# EAGLE design pc-003 (EAGLE 9.6.2)
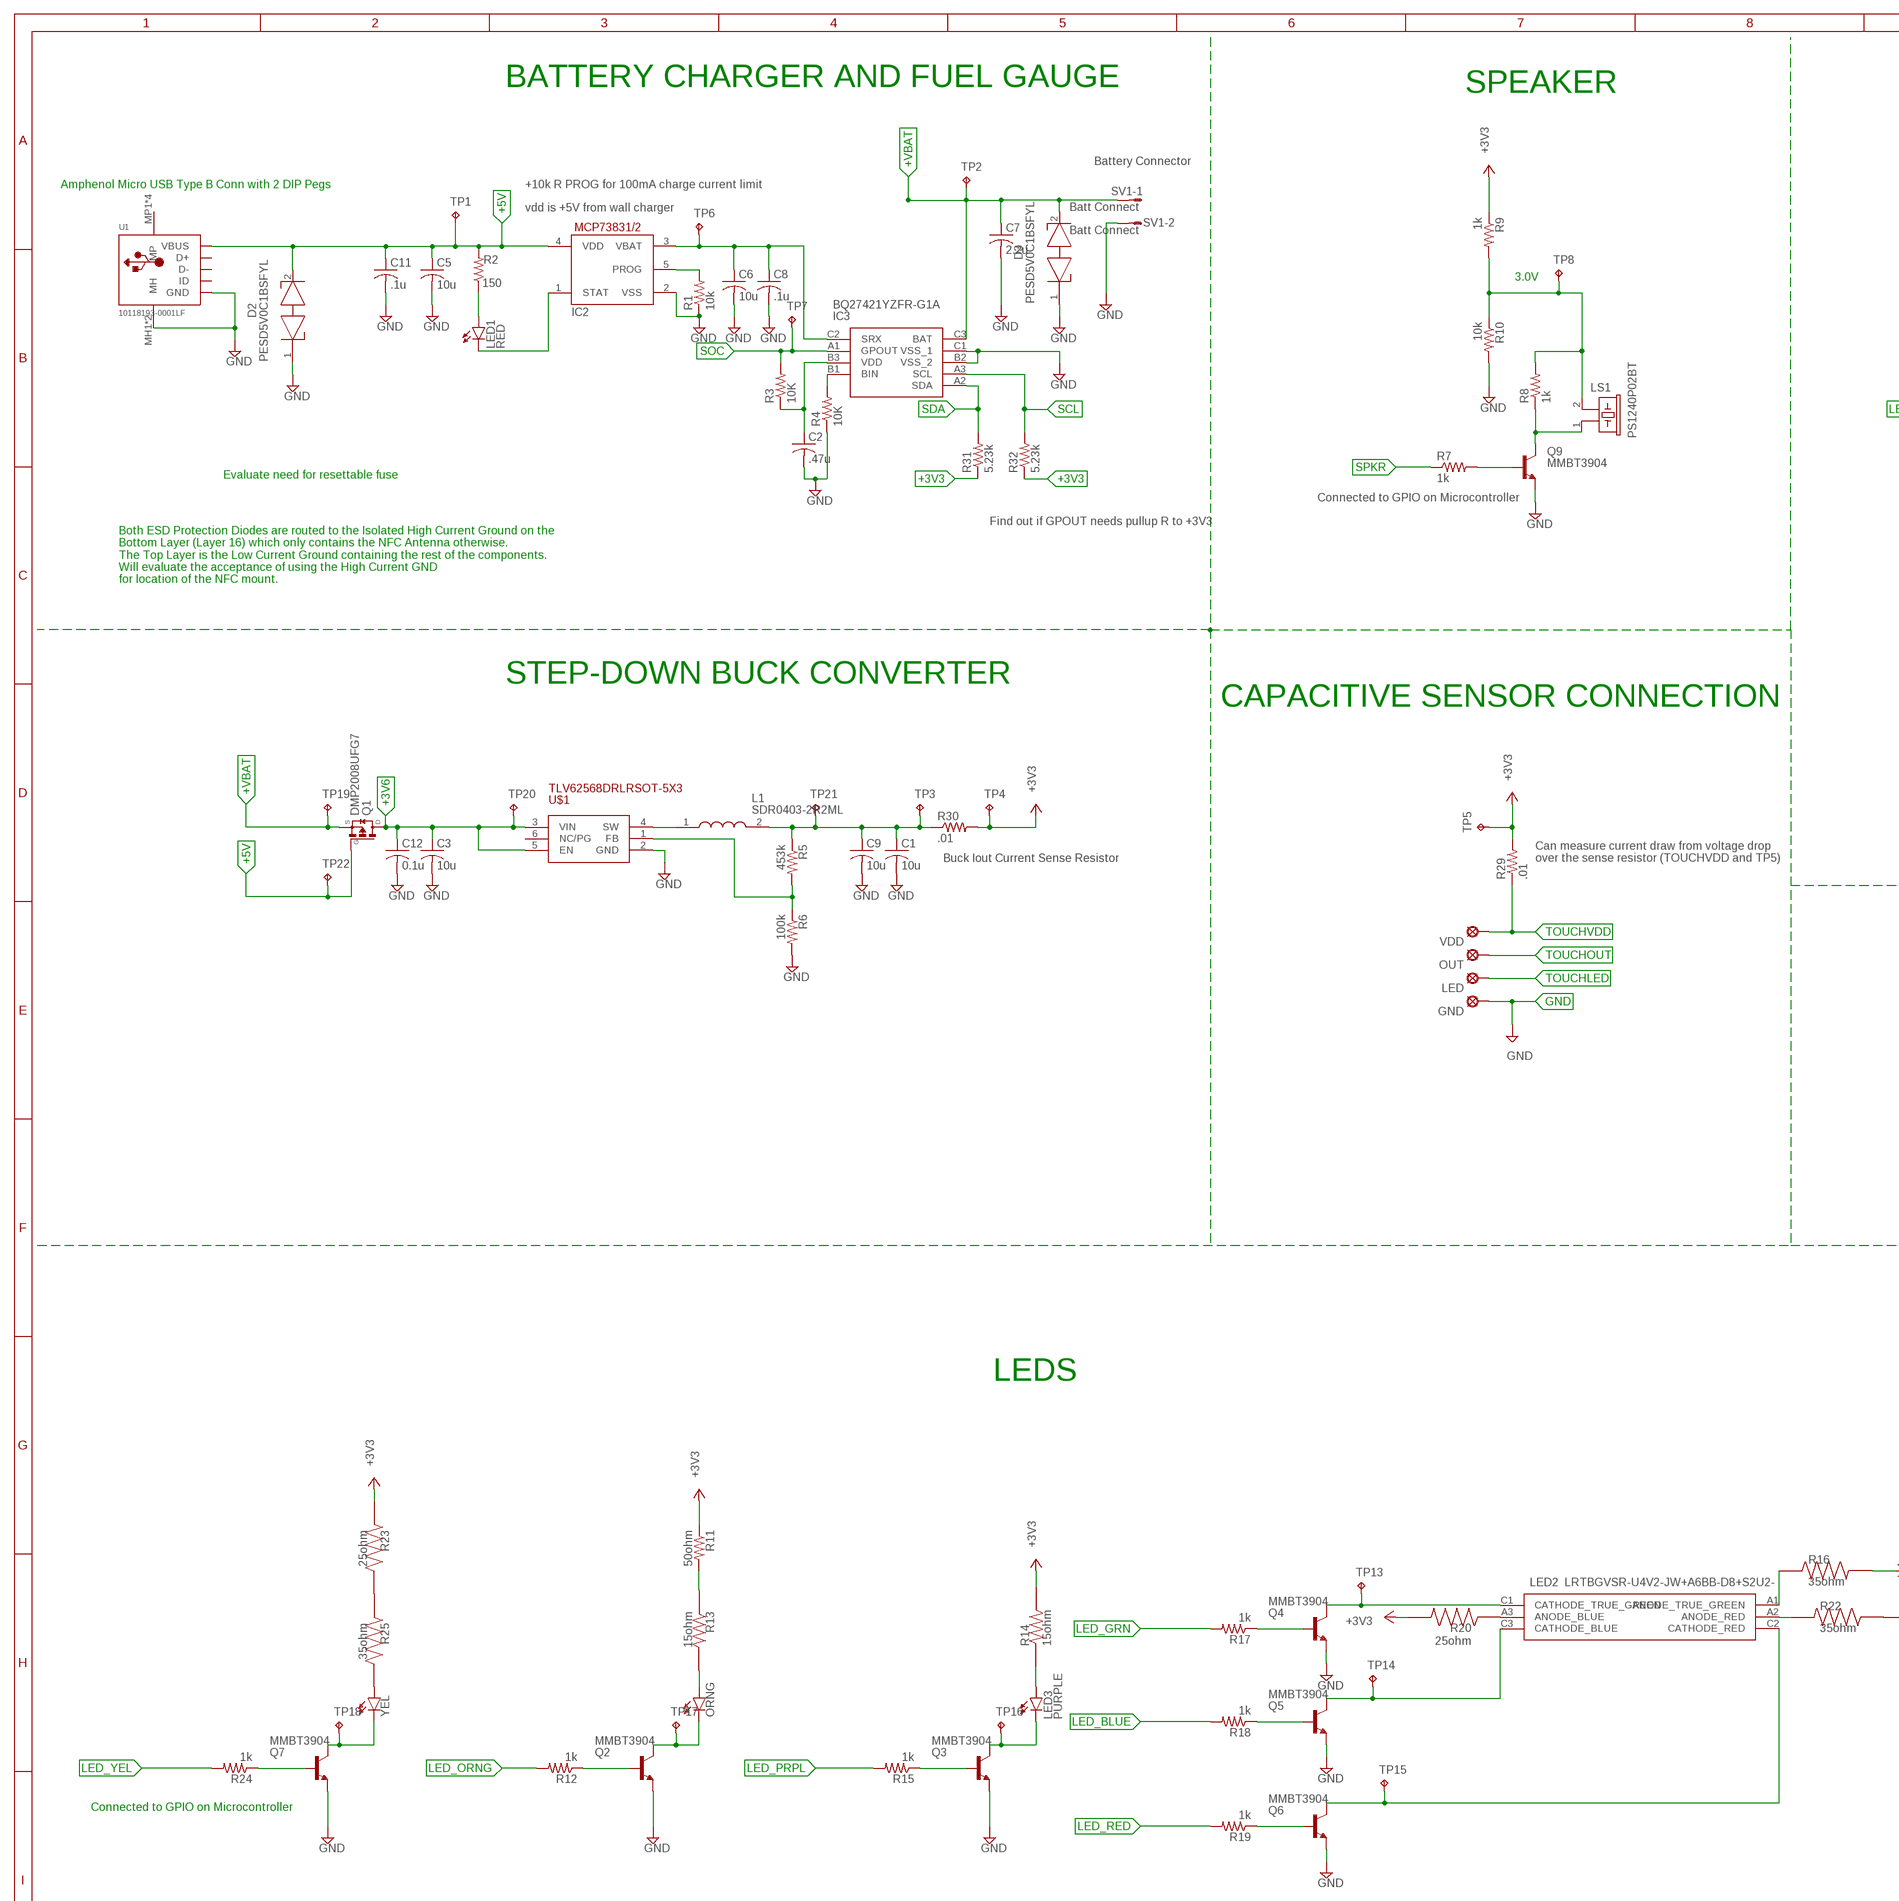
[diagram p0: schematic, sheet 1, part 1 of 2]
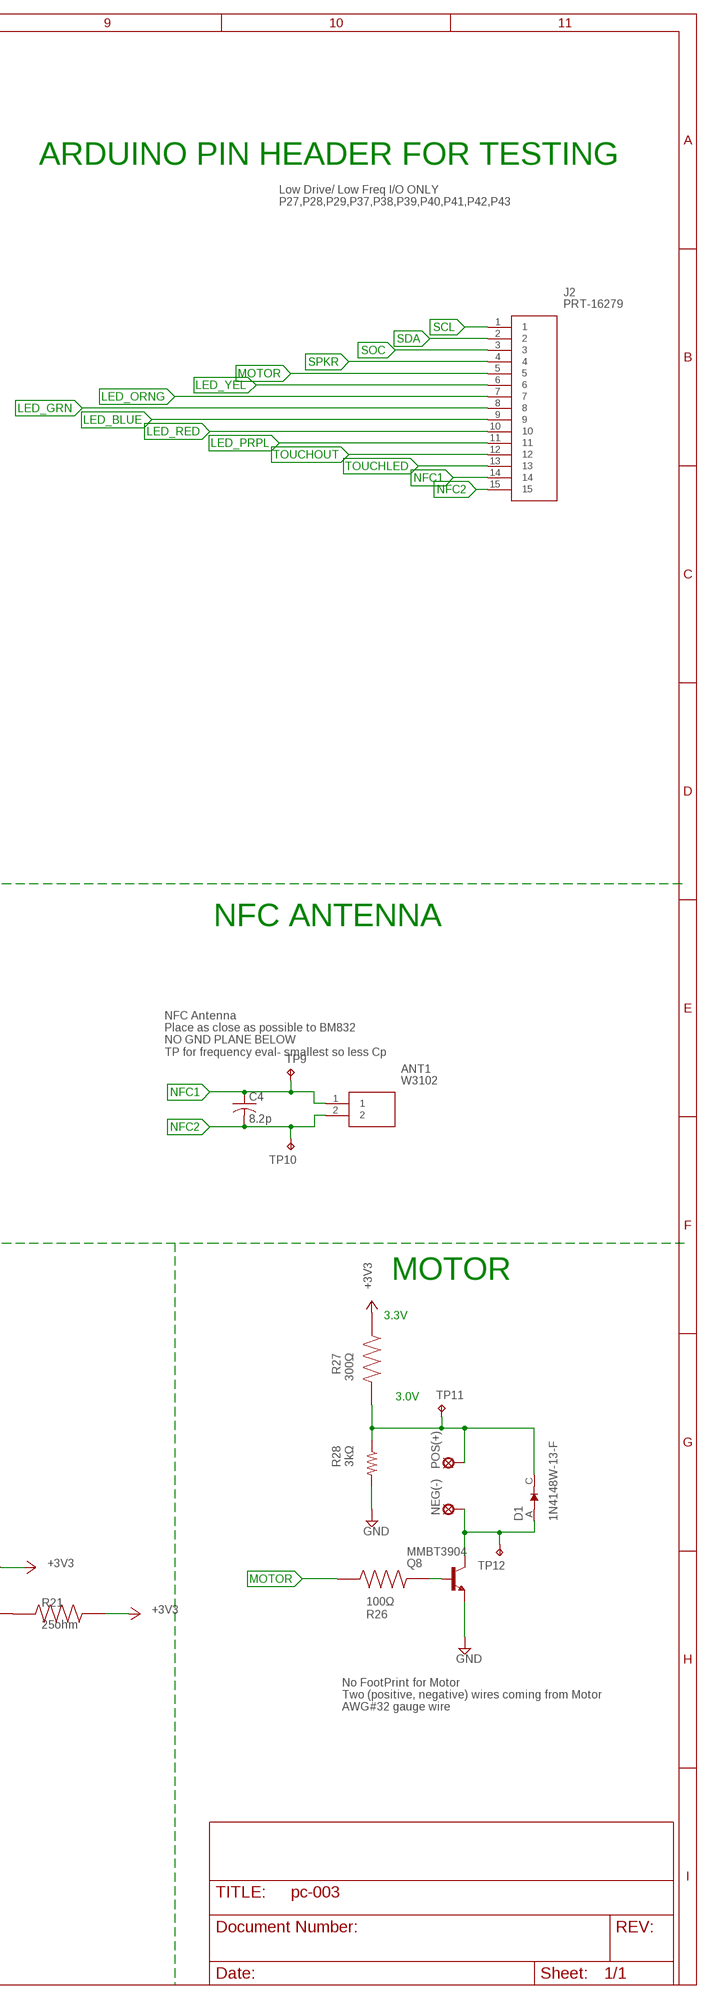
[diagram p1: schematic, sheet 1, part 2 of 2]

## Parts
ANT1  W3102  [W3102]
C1  10u  CL21A106KOQNNNE  [CAPC2012X140N]
C2  .47u  C-USC0603  [C0603]
C3  10u  CL21A106KOQNNNE  [CAPC2012X140N]
C4  8.2p  C-USC0402K  [C0402K]
C5  10u  CL21A106KOQNNNE  [CAPC2012X140N]
C6  10u  CL21A106KOQNNNE  [CAPC2012X140N]
C7  2.2u  C-USC0603  [C0603]
C8  .1u  C-USC0603  [C0603]
C9  10u  CL21A106KOQNNNE  [CAPC2012X140N]
C11  .1u  C-USC0603  [C0603]
C12  0.1u  C-USC0603  [C0603]
D1  1N4148W-13-F  [SOD3715X135N]
D2  PESD5V0C1BSFYL  [PMEG3005AESFYL]
D3  PESD5V0C1BSFYL  [PMEG3005AESFYL]
GND  LSP10  [LSP10]
IC2  MCP73831/OT  [SOT23-5L]
IC3  BQ27421YZFR-G1A  [BGA9C50P3X3_158X162X62]
J2  PRT-16279  [PRT16279]
L1  SDR0403-2R2ML  [SDR04032R2ML]
LED  LSP10  [LSP10]
LED1  RED  150060RS75000  [LEDC1608X80N]
LED2  LRTBGVSR-U4V2-JW+A6BB-D8+S2U2-  [LRTBGVSRU4V2JWA6BBD8S2U27Z20S]
LED3  PURPLE  APTR3216-VFX  [LEDC3216X125N]
LS1  PS1240P02BT  [PS1240P02BT]
NEG(-)  LSP10  [LSP10]
ORNG  HLMP6  [HLMP6]
OUT  LSP10  [LSP10]
POS(+)  LSP10  [LSP10]
Q1  DMP2008UFG7  DMP2008UFG  [DMP2008UFG7]
Q2  MMBT3904  MMBT3904-7-FNSMD  [SOT23]
Q3  MMBT3904  MMBT3904-7-FNSMD  [SOT23]
Q4  MMBT3904  MMBT3904-7-FNSMD  [SOT23]
Q5  MMBT3904  MMBT3904-7-FNSMD  [SOT23]
Q6  MMBT3904  MMBT3904-7-FNSMD  [SOT23]
Q7  MMBT3904  MMBT3904-7-FNSMD  [SOT23]
Q8  MMBT3904  MMBT3904-7-FNSMD  [SOT23]
Q9  MMBT3904  MMBT3904-7-FNSMD  [SOT23]
R1  10k  R-US_R0402  [R0402]
R2  150  R-US_R0402  [R0402]
R3  10K  R-US_R0402  [R0402]
R4  10K  R-US_R0402  [R0402]
R5  453k  R-US_R0402  [R0402]
R6  100k  R-US_R0603  [R0603]
R7  1k  CRCW06031K00FKEAC  [RESC1608X55N]
R8  1k  CRCW06031K00FKEAC  [RESC1608X55N]
R9  1k  CRCW06031K00FKEAC  [RESC1608X55N]
R10  10k  R-US_R0402  [R0402]
R11  50ohm  RT0402BRE0750RL  [RESC1005X35N]
R12  1k  CRCW06031K00FKEAC  [RESC1608X55N]
R13  15ohm  SR0603JR-0715RL  [RESC1608X55N]
R14  15ohm  SR0603JR-0715RL  [RESC1608X55N]
R15  1k  CRCW06031K00FKEAC  [RESC1608X55N]
R16  35ohm  RT0603BRD0735R2L  [RESC1608X55N]
R17  1k  CRCW06031K00FKEAC  [RESC1608X55N]
R18  1k  CRCW06031K00FKEAC  [RESC1608X55N]
R19  1k  CRCW06031K00FKEAC  [RESC1608X55N]
R20  25ohm  RQ73C2A25R5BTD  [RESC2012X65N]
R21  25ohm  RQ73C2A25R5BTD  [RESC2012X65N]
R22  35ohm  RT0603BRD0735R2L  [RESC1608X55N]
R23  25ohm  RQ73C2A25R5BTD  [RESC2012X65N]
R24  1k  CRCW06031K00FKEAC  [RESC1608X55N]
R25  35ohm  RT0603BRD0735R2L  [RESC1608X55N]
R26  100Ω  SR0603FR-7T100RL  [RESC1608X55N]
R27  300Ω  CRCW1206300RFKEAC  [RESC3015X65N]
R28  3kΩ  CR1206-FX-3001ELF  [RESC3216X75N]
R29  .01  R-US_R0603  [R0603]
R30  .01  PCS1206DR0100ET  [RESC3216X68N]
R31  5.23k  R-US_R0603  [R0603]
R32  5.23k  R-US_R0603  [R0603]
SV1  Batt Connect  L02P  [L02P]
TP1  TESTPOINT  [TESTPOINT_PAD-036]
TP2  TESTPOINT  [TESTPOINT_PAD-036]
TP3  TESTPOINT  [TESTPOINT_PAD-036]
TP4  TESTPOINT  [TESTPOINT_PAD-036]
TP5  TESTPOINT  [TESTPOINT_PAD-036]
TP6  TESTPOINT  [TESTPOINT_PAD-036]
TP7  TESTPOINT  [TESTPOINT_PAD-036]
TP8  TESTPOINT  [TESTPOINT_PAD-036]
TP9  TESTPOINT  [TESTPOINT_PAD-036]
TP10  TESTPOINT  [TESTPOINT_PAD-036]
TP11  TESTPOINT  [TESTPOINT_PAD-036]
TP12  TESTPOINT  [TESTPOINT_PAD-036]
TP13  TESTPOINT  [TESTPOINT_PAD-036]
TP14  TESTPOINT  [TESTPOINT_PAD-036]
TP15  TESTPOINT  [TESTPOINT_PAD-036]
TP16  TESTPOINT  [TESTPOINT_PAD-036]
TP17  TESTPOINT  [TESTPOINT_PAD-036]
TP18  TESTPOINT  [TESTPOINT_PAD-036]
TP19  TESTPOINT  [TESTPOINT_PAD-036]
TP20  TESTPOINT  [TESTPOINT_PAD-036]
TP21  TESTPOINT  [TESTPOINT_PAD-036]
TP22  TESTPOINT  [TESTPOINT_PAD-036]
U1  10118193-0001LF  [101181930001LF]
U$1  TLV62568DRLRSOT-5X3  [SOT50P160X60-6N]
VDD  LSP10  [LSP10]
YEL  HLMP6  [HLMP6]

## Nets
+3V3: R9.1 R11.1 R14.2 R16.2 R20.2 R21.2 R23.1 R27.1 R29.2 R30.2 R31.1 R32.1 TP4.1(TP) TP5.1(TP)
+3V6: C3.1 C12.1 Q1.5(D) Q1.6(D) Q1.7(D) Q1.8(D) Q1.9(D) TP20.1(TP) U$1.3(VIN) U$1.5(EN)
+5V: C5.1 C11.1 D2.2(K2) IC2.4(VDD) Q1.4(G) R2.2 TP1.1(TP) TP22.1(TP) U1.1(VBUS)
+VBAT: C7.1 D3.2(K2) IC3.C3(BAT) Q1.1(S) Q1.2(S) Q1.3(S) SV1.1 TP2.1(TP) TP19.1(TP)
GND: C1.2 C2.2 C3.2 C5.2 C6.2 C7.2 C8.2 C9.2 C11.2 C12.2 D2.1(K1) D3.1(K1) GND.MP IC2.2(VSS) IC3.B2(VSS_2) IC3.C1(VSS_1) Q2.2(E) Q3.2(E) Q4.2(E) Q5.2(E) Q6.2(E) Q7.2(E) Q8.2(E) Q9.2(E) R1.1 R4.1 R6.2 R10.2 R28.2 SV1.2 U1.5(GND) U1.MH1(MH) U1.MH2(MH) U$1.2(GND)
LED_BLUE: J2.9 R18.2
LED_GRN: J2.8 R17.2
LED_ORNG: J2.7 R12.2
LED_PRPL: J2.11 R15.2
LED_RED: J2.10 R19.2
LED_YEL: J2.6 R24.2
MOTOR: J2.5 R26.1
N$1: Q9.1(B) R7.2
N$3: LS1.1 Q9.3(C) R8.1
N$4: IC2.5(PROG) R1.2
N$5: L1.1 U$1.4(SW)
N$6: R5.2 R6.1 U$1.1(FB)
N$7: IC2.1(STAT) LED1.1(C)
N$8: LED1.2(A) R2.1
N$9: Q8.1(B) R26.2
N$10: IC3.B1(BIN) R4.2
N$12: LS1.2 R8.2 R9.2 R10.1 TP8.1(TP)
N$13: D1.C(K) POS(+).MP R27.2 R28.1 TP11.1(TP)
N$14: Q2.1(B) R12.1
N$15: ORNG.K Q2.3(C) TP17.1(TP)
N$16: R11.2 R13.1
N$17: ORNG.A R13.2
N$18: C1.1 C9.1 L1.2 R5.1 R30.1 TP3.1(TP) TP21.1(TP)
N$19: Q3.1(B) R15.1
N$20: LED3.1(C) Q3.3(C) TP16.1(TP)
N$21: LED3.2(A) R14.1
N$22: R21.1 R22.2
N$23: Q4.1(B) R17.1
N$24: LED2.C1(CATHODE_TRUE_GREEN) Q4.3(C) TP13.1(TP)
N$25: D1.A NEG(-).MP Q8.3(C) TP12.1(TP)
N$26: Q5.1(B) R18.1
N$27: C6.1 C8.1 IC2.3(VBAT) IC3.C2(SRX) TP6.1(TP)
N$28: Q6.1(B) R19.1
N$29: LED2.C3(CATHODE_BLUE) Q5.3(C) TP14.1(TP)
N$30: LED2.A3(ANODE_BLUE) R20.1
N$31: LED2.A1(ANODE_TRUE_GREEN) R16.1
N$32: LED2.C2(CATHODE_RED) Q6.3(C) TP15.1(TP)
N$33: LED2.A2(ANODE_RED) R22.1
N$36: Q7.1(B) R24.1
N$37: Q7.3(C) TP18.1(TP) YEL.K
N$38: R25.2 YEL.A
N$39: R23.2 R25.1
N$43: C2.1 IC3.B3(VDD) R3.1
NFC1: ANT1.1 C4.1 J2.14 TP9.1(TP)
NFC2: ANT1.2 C4.2 J2.15 TP10.1(TP)
SCL: IC3.A3(SCL) J2.1 R32.2
SDA: IC3.A2(SDA) J2.2 R31.2
SOC: IC3.A1(GPOUT) J2.3 R3.2 TP7.1(TP)
SPKR: J2.4 R7.1
TOUCHLED: J2.13 LED.MP
TOUCHOUT: J2.12 OUT.MP
TOUCHVDD: R29.1 VDD.MP
Unconnected: U1.2(D+) U1.3(D-) U1.4(ID) U1.MP1(MP) U1.MP2(MP) U1.MP3(MP) U1.MP4(MP) U$1.6(NC/PG)

## Notes on the sheet
- BATTERY CHARGER AND FUEL GAUGE | SPEAKER
- Battery Connector | ARDUINO PIN HEADER FOR TESTING
- Amphenol Micro USB Type B Conn with 2 DIP Pegs | +10k R PROG for 100mA charge current limit
- Low Drive/ Low Freq I/O ONLY
  P27,P28,P29,P37,P38,P39,P40,P41,P42,P43
- vdd is +5V from wall charger
- 3.0V
- Evaluate need for resettable fuse
- Connected to GPIO on Microcontroller
- Find out if GPOUT needs pullup R to +3V3
- Both ESD Protection Diodes are routed to the Isolated High Current Ground on the 
  Bottom Layer (Layer 16) which only contains the NFC Antenna otherwise. 
  The Top Layer is the Low Current Ground containing the rest of the components. 
  Will evaluate the acceptance of using the High Current GND 
  for location of the NFC mount.
- STEP-DOWN BUCK CONVERTER
- CAPACITIVE SENSOR CONNECTION
- Buck Iout Current Sense Resistor
- Can measure current draw from voltage drop 
  over the sense resistor (TOUCHVDD and TP5)
- NFC ANTENNA
- NFC Antenna
  Place as close as possible to BM832
  NO GND PLANE BELOW
  TP for frequency eval- smallest so less Cp
- MOTOR
- 3.3V
- LEDS
- 3.0V
- No FootPrint for Motor 
  Two (positive, negative) wires coming from Motor
  AWG#32 gauge wire
- Connected to GPIO on Microcontroller

## Library data of the parts
ANT1 = SamacSys_Parts:W3102: Antennas Ant Embedded NFC 13.56MHz Source: Datasheet <https://productfinder.pulseeng.com/doc_type/WEB301/doc_num/W3102/doc_part/W3102-1851 TDS.pdf>; DESCRIPTION: Antennas Ant Embedded NFC 13.56MHz; HEIGHT: 5.35mm; MANUFACTURER_NAME: Pulse; MANUFACTURER_PART_NUMBER: W3102; MOUSER_PART_NUMBER: 673-W3102; MOUSER_PRICE-STOCK: https://www.mouser.co.uk/ProductDetail/PulseLarsen-Antennas/W3102/?qs=l7cgNqFNU1hiMYyn%252B8mDRg%3D%3D
C1 C3 C5 C6 C9 = tesseract:CL21A106KOQNNNE
C2 C4 C7 C8 C11 C12 = rcl:C-US: CAPACITOR, American symbol; SPICEPREFIX: C
D1 = 1N4148W-13-F:1N4148W-13-F: 1N4148W Series 2 A 100 V 400 mW Surface Mount Fast Switching Diode - SOD-123 Check prices <https://pricing.snapeda.com/parts/1N4148W-13-F/Diodes%20Zetex/view-part?ref=eda>; AVAILABILITY: Warning; DESCRIPTION: Rectifier Diode Small Signal Switching 100V 0.3A 4ns 2-Pin SOD-123 T/R; MF: Diodes Zetex; MP: 1N4148W-13-F; PACKAGE: None; PRICE: None; PURCHASE-URL: https://pricing.snapeda.com/search/part/1N4148W-13-F/?ref=eda
D2 D3 = SamacSys_Parts:PESD5V0C1BSFYL: PESD5V0C1BSF - Ultra low capacitance bidirectional ESD protection diode Source: Datasheet <https://assets.nexperia.com/documents/data-sheet/PESD5V0C1BSF.pdf>; DESCRIPTION: PESD5V0C1BSF - Ultra low capacitance bidirectional ESD protection diode; HEIGHT: mm; MANUFACTURER_NAME: Nexperia; MANUFACTURER_PART_NUMBER: PESD5V0C1BSFYL; MOUSER_PART_NUMBER: 771-PESD5V0C1BSFYL; MOUSER_PRICE-STOCK: https://www.mouser.co.uk/ProductDetail/Nexperia/PESD5V0C1BSFYL?qs=Pve5fMu%2FDEv%252BAQF4BlT7Aw%3D%3D
GND LED NEG(-) OUT POS(+) VDD = solpad:LSP10: SOLDER PAD drill 1.0 mm, distributor Buerklin, 12H555
IC2 = adafruit:MCP73831: MCP73831/2 Miniature Single-Cell, Fully Integrated Li-Ion, Li-Polymer Charge Management Controllers. Nice and small simple lipoly charge controller, with adjustable current and status output (LED) http://www.ladyada.net/library/pcb/eaglelibrary.html
IC3 = tesseract:BQ27421YZFR-G1A
J2 = SamacSys_Parts:PRT-16279: ARDUINO NANO STACKABLE HEADERS Source: Datasheet <https://cdn.sparkfun.com/assets/8/d/8/4/7/DS-16279-Arduino_Nano_Stackable_Header_Kit.pdf>; DESCRIPTION: ARDUINO NANO STACKABLE HEADERS; HEIGHT: 8.65mm; MANUFACTURER_NAME: SparkFun; MANUFACTURER_PART_NUMBER: PRT-16279; MOUSER_PART_NUMBER: 474-PRT-16279; MOUSER_PRICE-STOCK: https://www.mouser.co.uk/ProductDetail/SparkFun/PRT-16279?qs=vmHwEFxEFR8I6W1vfufYPg%3D%3D
L1 = SamacSys_Parts:SDR0403-2R2ML: Bourns SDR0403 Series Type SMD Wire-wound SMD Inductor with a Ferrite DR Core, 2.2 uH +/-20% 2.6A Idc Q:28 Source: Datasheet <https://www.bourns.com/docs/Product-Datasheets/sdr0403.pdf>; DESCRIPTION: Bourns SDR0403 Series Type SMD Wire-wound SMD Inductor with a Ferrite DR Core, 2.2 uH +/-20% 2.6A Idc Q:28; HEIGHT: 3.5mm; MANUFACTURER_NAME: Bourns; MANUFACTURER_PART_NUMBER: SDR0403-2R2ML; MOUSER_PART_NUMBER: 652-SDR0403-2R2ML; MOUSER_PRICE-STOCK: https://www.mouser.co.uk/ProductDetail/Bourns/SDR0403-2R2ML?qs=y9m3SKnhpLO4vEJCCQMjFg%3D%3D
LED1 = tesseract:150060RS75000
LED2 = LRTBGVSR-U4V2-JW+A6BB-D8+S2U2-:LRTBGVSR-U4V2-JW+A6BB-D8+S2U2-: Standard LEDs - SMD RGB LED OSIRE E3635 Source: Datasheet <https://componentsearchengine.com///C:/Users/jayres/Downloads/LRTB GVSR_EN (1).pdf>; DESCRIPTION: Standard LEDs - SMD RGB LED OSIRE E3635; HEIGHT: 2mm; MANUFACTURER_NAME: OSRAM; MANUFACTURER_PART_NUMBER: LRTBGVSR-U4V2-JW+A6BB-D8+S2U2-7Z-20-S; MOUSER_PART_NUMBER: 720-LRTBGVSRA8552; MOUSER_PRICE-STOCK: https://www.mouser.co.uk/ProductDetail/OSRAM-Opto-Semiconductors/LRTBGVSR-U4V2-JW%2bA6BB-D8%2bS2U2-7Z-20-S?qs=sPbYRqrBIVl6x9fY0QkiyA%3D%3D
LED3 = tesseract:APTR3216-VFX
LS1 = tesseract:PS1240P02BT: Audio Indicators & Alerts Round 12.2mmx6.5mm 4kHz Vin=3V Source: Datasheet; DESCRIPTION: Audio Indicators & Alerts Round 12.2mmx6.5mm 4kHz Vin=3V; HEIGHT: mm; MANUFACTURER_NAME: TDK; MANUFACTURER_PART_NUMBER: PS1240P02BT; MOUSER_PART_NUMBER: 810-PS1240P02BT; MOUSER_PRICE-STOCK: https://www.mouser.co.uk/ProductDetail/TDK/PS1240P02BT?qs=d7g9p1yFhWaZXSY9MjKMkw%3D%3D
ORNG YEL = display-hp:HLMP6: LED 2mm horizontal; MF: AGILENT TECHNOLOGIES; MPN: HLMP-6500; OC_FARNELL: 1652490; OC_NEWARK: 40K0088
Q1 = SamacSys_Parts:DMP2008UFG
Q2-Q9 = tesseract:MMBT3904-7-F
R1-R6 R10 R29 R31 R32 = rcl:R-US_: RESISTOR, American symbol; SPICEPREFIX: R
R7-R9 R12 R15 R17-R19 R24 = tesseract:CRCW06031K00FKEAC
R11 = tesseract:RT0402BRE0750RL
R13 R14 = tesseract:SR0603JR-0715RL: Check prices <https://pricing.snapeda.com/parts/SR0603JR-0715RL/Yageo/view-part?ref=eda>; AVAILABILITY: Bad; DESCRIPTION: Res Thick Film 0603 15 Ohm 5% 0.1W(1/10W) ±100ppm/°C Pad SMD Automotive T/R; MF: Yageo; MP: SR0603JR-0715RL; PACKAGE: 1608 Yageo; PRICE: None
R16 R22 R25 = tesseract:RT0603BRD0735R2L; AVAILABILITY: Unavailable; DESCRIPTION: 35.2 Ohms ±0.1% 0.1W, 1/10W Chip Resistor 0603 (1608 Metric) Thin Film; MF: Yageo; MP: RT0603BRD0735R2L; PACKAGE: 1608 Yageo; PRICE: None
R20 R21 R23 = tesseract:RQ73C2A25R5BTD: Check prices <https://pricing.snapeda.com/parts/RQ73C2A25R5BTD/TE%20Connectivity/view-part?ref=eda>; AVAILABILITY: Warning; COMMENT: 4-2176378-0; DESCRIPTION: 25.5 Ohms ±0.1% 0.2W, 1/5W Chip Resistor 0805 (2012 Metric) Anti-Sulfur, Automotive AEC-Q200 Thin Film; MF: TE Connectivity; MP: RQ73C2A25R5BTD; PACKAGE: 2012 Rohm Semiconductor; PRICE: None; PURCHASE-URL: https://pricing.snapeda.com/search/part/RQ73C2A25R5BTD/?ref=eda
R26 = tesseract:SR0603FR-7T100RL: Check prices <https://pricing.snapeda.com/parts/SR0603FR-7T100RL/Yageo/view-part?ref=eda>; AVAILABILITY: Warning; DESCRIPTION: 100 Ohms ±1% 0.25W, 1/4W Chip Resistor 0603 (1608 Metric) Automotive AEC-Q200, Pulse Withstanding Thick Film; MF: Yageo; MP: SR0603FR-7T100RL; PACKAGE: 1608 Yageo; PRICE: None
R27 = tesseract:CRCW1206300RFKEAC: Check prices <https://pricing.snapeda.com/parts/CRCW1206300RFKEAC/Vishay/view-part?ref=eda>; AVAILABILITY: Warning; DESCRIPTION: 300 Ohms ±1% 0.25W, 1/4W Chip Resistor 1206 (3216 Metric) Thick Film; MF: Vishay; MP: CRCW1206300RFKEAC; PACKAGE: 3015 Vishay; PRICE: None; PURCHASE-URL: https://pricing.snapeda.com/search/part/CRCW1206300RFKEAC/?ref=eda
R28 = tesseract:CR1206-FX-3001ELF
R30 = SamacSys_Parts:PCS1206DR0100ET: Current Sense Resistors - SMD 1W 0.010 OHMS 0.5% Source: Datasheet <https://componentsearchengine.com//PCS1206DR0100ET.pdf>; DESCRIPTION: Current Sense Resistors - SMD 1W 0.010 OHMS 0.5%; HEIGHT: 0.684mm; MANUFACTURER_NAME: Ohmite; MANUFACTURER_PART_NUMBER: PCS1206DR0100ET; MOUSER_PART_NUMBER: 588-PCS1206DR0100ET; MOUSER_PRICE-STOCK: https://www.mouser.co.uk/ProductDetail/Ohmite/PCS1206DR0100ET?qs=Zz7%252BYVVL6bH%2F2nwIEMOhrA%3D%3D
SV1 = con-amp-mt:L02P: AMP MT CONNECTOR; OC_FARNELL: unknown; OC_NEWARK: unknown
TP1-TP22 = tesseract:TESTPOINT
U1 = tesseract:10118193-0001LF
U$1 = tesseract:TLV62568DRLR

## Board
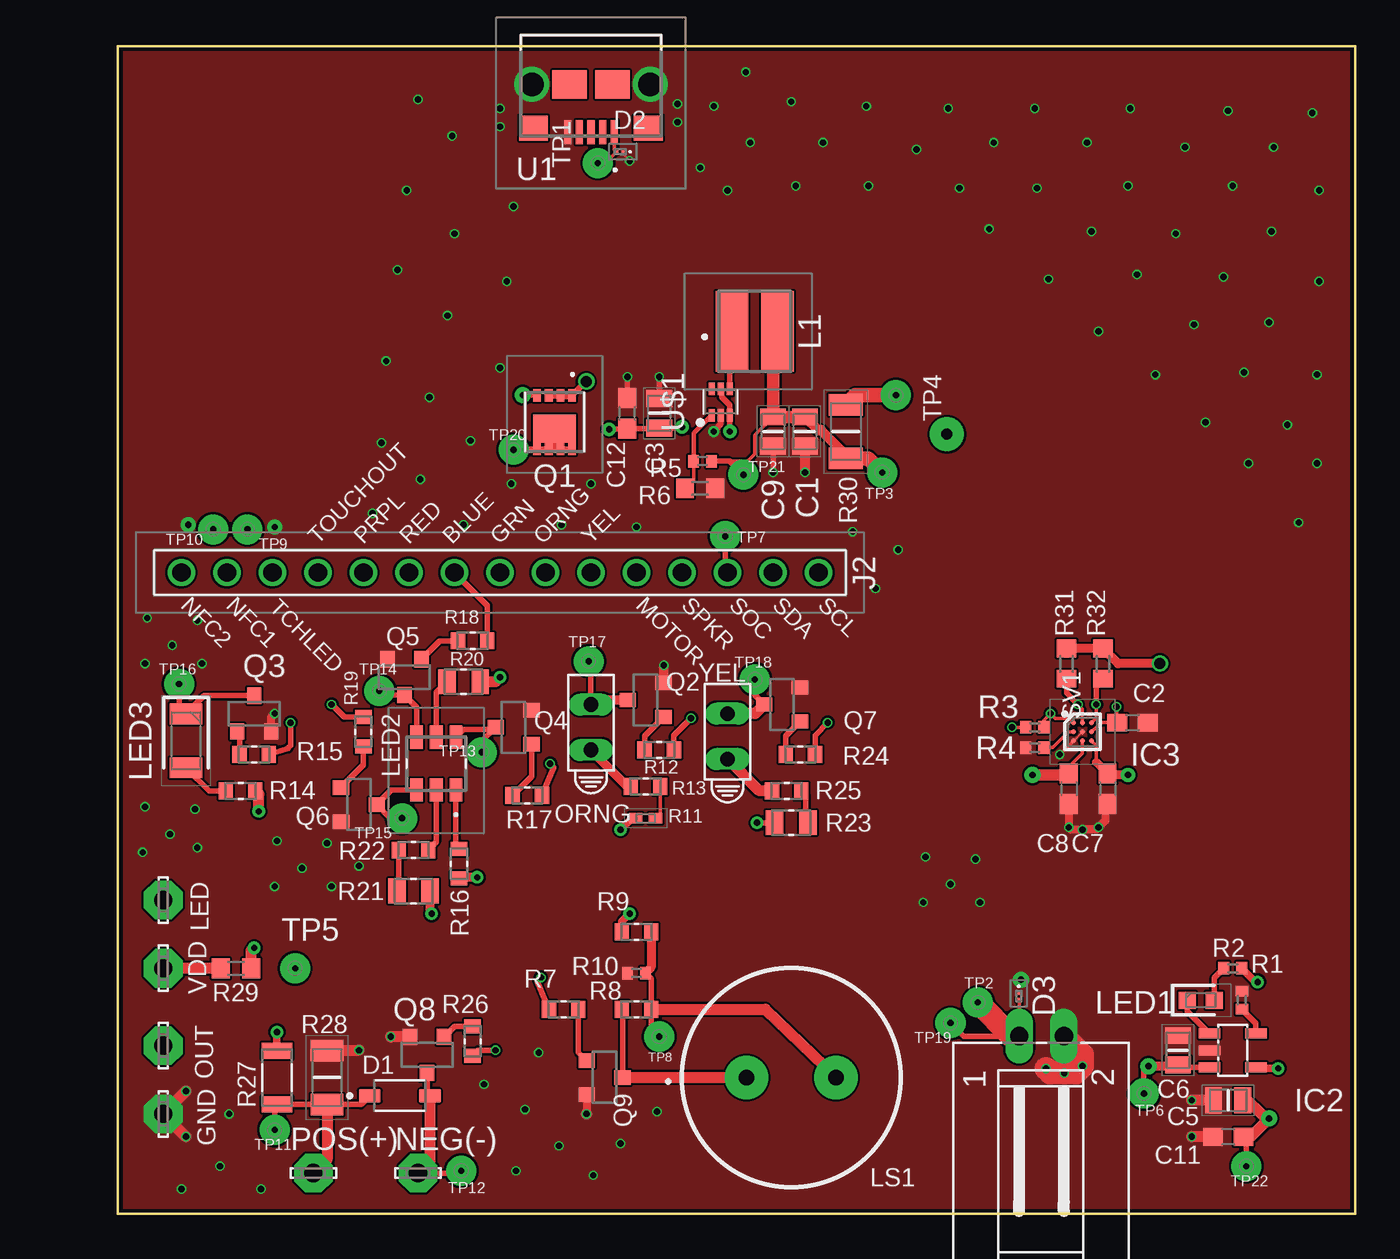
[diagram p2: board, top side]
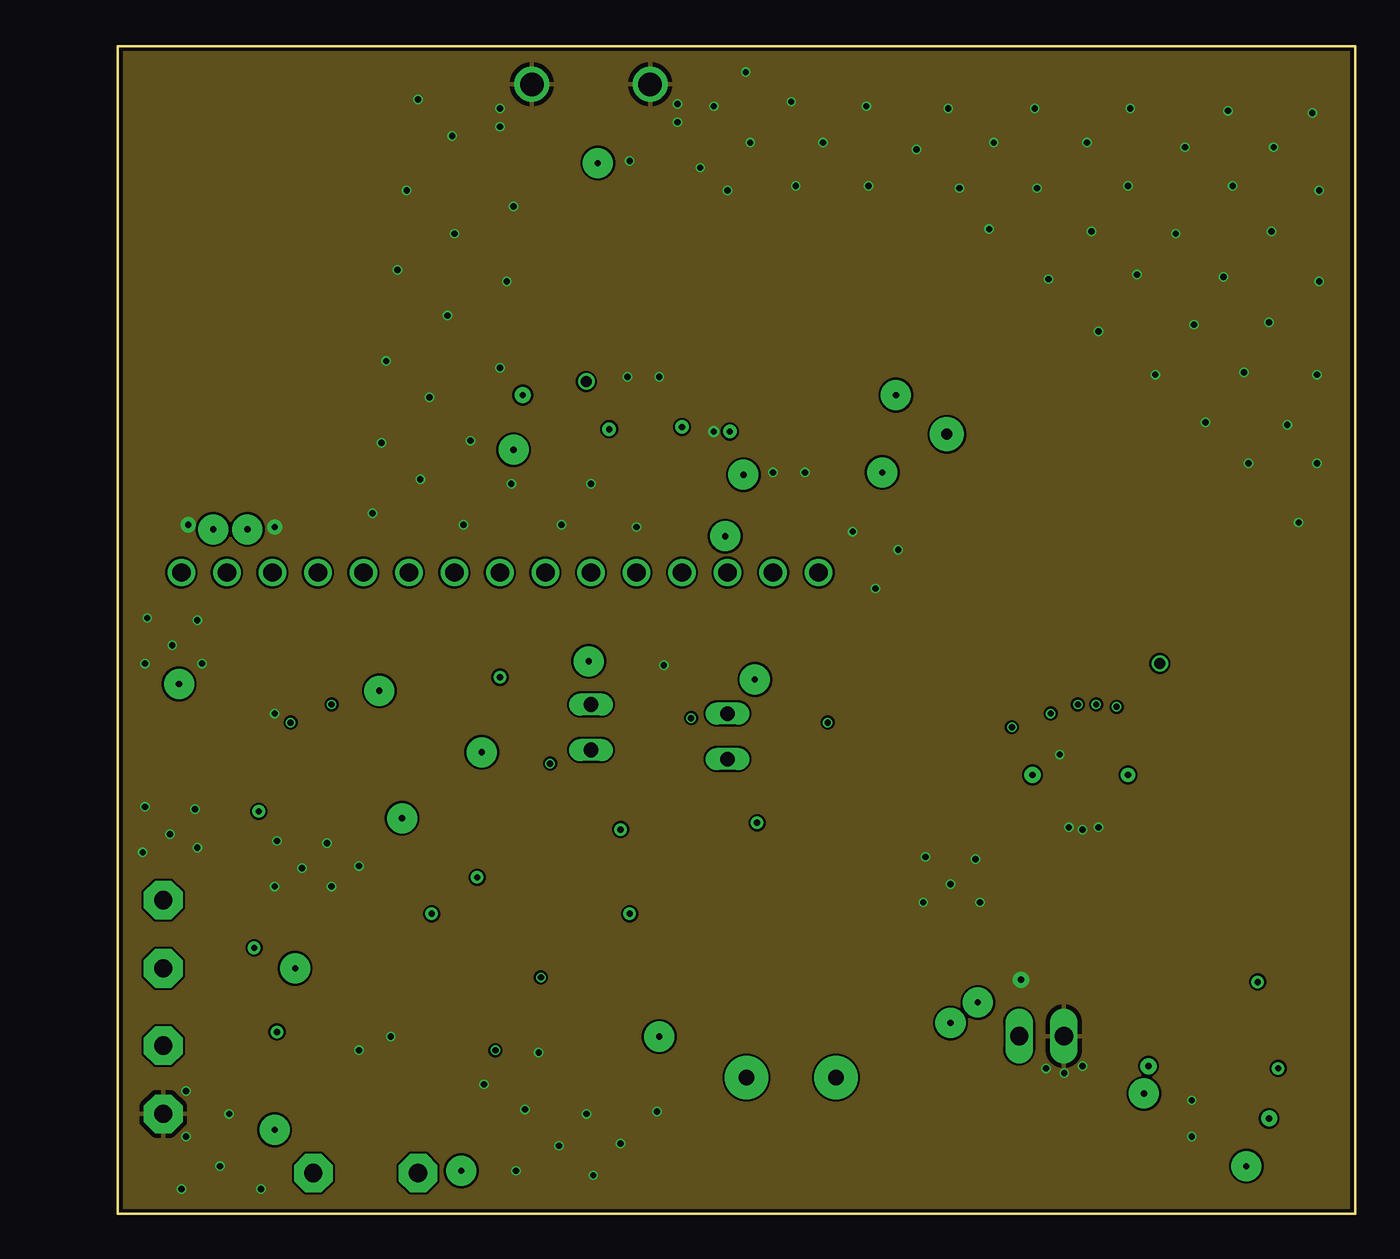
[diagram p3: board, inner layer Route2]
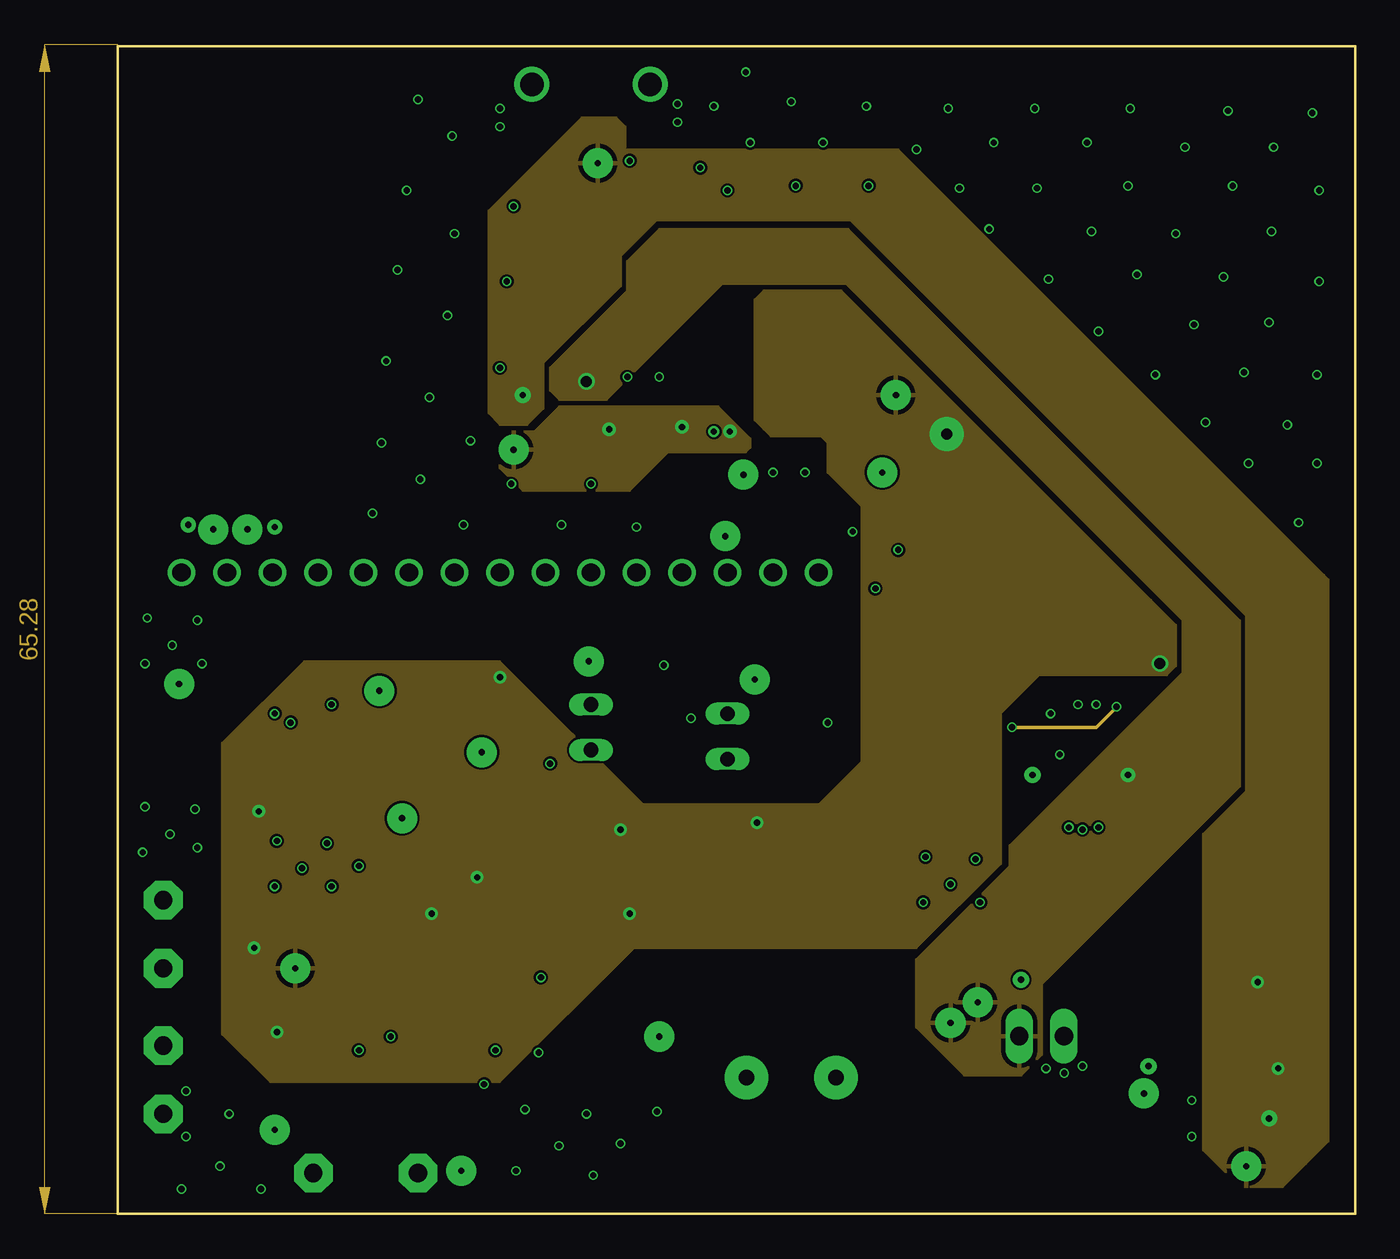
[diagram p4: board, inner layer Route15]
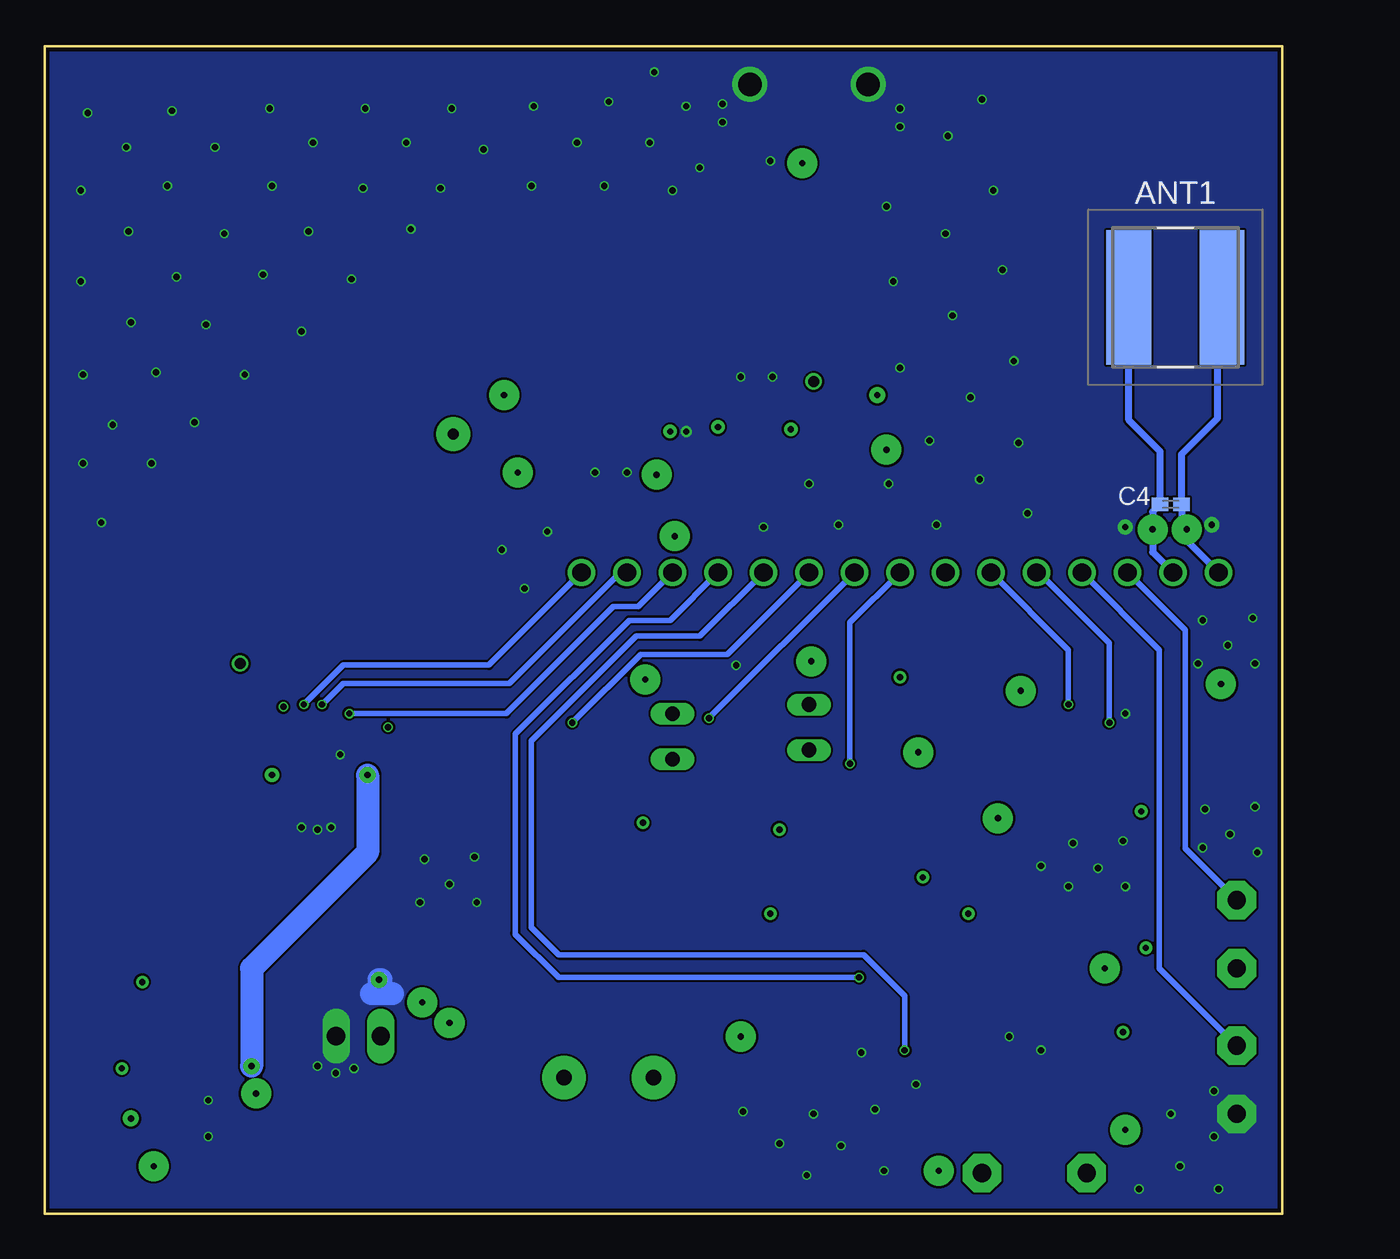
[diagram p5: board, bottom side, seen from below]

Size 69.07 x 65.2 mm. Coordinates in mm from the lower left corner, seen from the top.
Outline: 0,0 69.07,0 69.07,65.2 0,65.2 0,0
Copper layers (1+2*15+16): Top 0.035559375mm / dielectric 1.6mm / Route2 0.0356mm / dielectric 0.1499mm / Route15 0.0356mm / dielectric 0.2007mm / Bottom 0.035559375mm
Design rules "jlcpcb2layer *": minimum track width 5mil, minimum drill 8mil, track to track 5mil, track to pad 5mil, pad to pad 5mil, via to via 5mil, smd to smd 5mil, copper to edge 8mil, drill to drill 6mil, minimum pad ring 5mil, minimum via ring 3mil, stop-mask expansion 2.5mil, vias tented up to drill 0mil, thermal gap 10mil

### Footprints (pad centres in the part's own frame; a part is rotated, then mirrored left to right if it is on the bottom)
W3102 = smd 2.5 x 7.5: 1 -2.6,0; 2 2.6,0
CAPC2012X140N = smd 0.94 x 1.43: 1 -0.82,0; 2 0.82,0
C0603 = smd 1.1 x 1: 1 -0.85,0; 2 0.85,0
C0402K = smd 0.925 x 0.74: 1 -0.6,0; 2 0.6,0
SOD3715X135N = smd 1.21 x 0.73: A 1.68,0; C -1.68,0
PMEG3005AESFYL = smd 0.2 x 0.28: 1 -0.05,0; 2 0.35,0
LSP10 = drill 1.016 pad 2.159 octagon: MP 0,0
SOT23-5L = smd 0.55 x 1.2: 1 -0.95,-1.3; 2 0,-1.3; 3 0.95,-1.3; 4 0.95,1.3; 5 -0.95,1.3
BGA9C50P3X3_158X162X62 = smd 0.29 x 0.29: A1 -0.5,0.5; A2 0,0.5; A3 0.5,0.5; B1 -0.5,0; B2 0,0; B3 0.5,0; C1 -0.5,-0.5; C2 0,-0.5; C3 0.5,-0.5
PRT16279 = drill 1.02 pad 1.53: 1 0,0; 2 2.54,0; 3 5.08,0; 4 7.62,0; 5 10.16,0; 6 12.7,0; 7 15.24,0; 8 17.78,0; 9 20.32,0; 10 22.86,0; 11 25.4,0; 12 27.94,0; 13 30.48,0; 14 33.02,0; 15 35.56,0
SDR04032R2ML = smd 4.5 x 1.8: 1 0,1.27; 2 0,-1.27
LEDC1608X80N = smd 0.95 x 0.95: 1 -0.75,0; 2 0.75,0
LRTBGVSRU4V2JWA6BBD8S2U27Z20S = smd 0.7 x 1.3: A1 -1.1,1.475; A2 0,1.475; A3 0,-1.475; C1 -1.1,-1.475; C2 1.1,1.475; C3 1.1,-1.475
LEDC3216X125N = smd 1.15 x 1.8: 1 -1.5,0; 2 1.5,0
PS1240P02BT = drill 0.85 pad 2.413: 1 0,2.5; 2 0,-2.5
HLMP6 = drill 0.813 long: A -1.27,0; K 1.27,0
DMP2008UFG7 = smd 0.42 x 0.7: 1 -0.975,0; 2 -0.325,0; 3 0.325,0; 4 0.975,0; 5 0.975,3; 6 0.325,3; 7 -0.325,3; 8 -0.975,3 | smd 2.37 x 1.55: 9 0,1.875
SOT23 = smd 0.8 x 0.9: 1 -0.95,-1; 2 0.95,-1; 3 0,1
R0402 = smd 0.6 x 0.7: 1 -0.5,0; 2 0.5,0
R0603 = smd 1 x 1.1: 1 -0.85,0; 2 0.85,0
RESC1608X55N = smd 0.79 x 0.93: 1 -0.82,0; 2 0.82,0
RESC1005X35N = smd 0.75 x 0.6: 1 -0.55,0; 2 0.55,0
RESC2012X65N = smd 0.97 x 1.38: 1 -0.93,0; 2 0.93,0
RESC3015X65N = smd 0.89 x 1.68: 1 -1.495,0; 2 1.495,0
RESC3216X75N = smd 1.2 x 1.8: 1 -1.5,0; 2 1.5,0
RESC3216X68N = smd 1.2 x 1.9: 1 -1.5,0; 2 1.5,0
L02P = drill 1.016 long: 1 1.25,-6.25; 2 -1.25,-6.25
TESTPOINT_PAD-036 = drill 0.35 pad 1.676: 1 0,0
101181930001LF = smd 0.4 x 1.35: 1 -1.3,2.6; 2 -0.65,2.6; 3 0,2.6; 4 0.65,2.6; 5 1.3,2.6 | drill 1.3 pad 1.95: MH1 -3.3,-0.075; MH2 3.3,-0.075 | smd 1.6 x 1.4: MP1 -3.2,2.375; MP4 3.2,2.375 | smd 1.9 x 1.6: MP2 -1.2,-0.075; MP3 1.2,-0.075
SOT50P160X60-6N = smd 0.7 x 0.35: 1 -0.735,0.5; 2 -0.735,0; 3 -0.735,-0.5; 4 0.735,-0.5; 5 0.735,0; 6 0.735,0.5

### Placement (x,y rotation side)
ANT1  5.97,51.18 0 bottom
C1  38.35,43.69 270 top
C2  56.64,27.43 0 top
C3  30.23,44.7 90 top
C4  6.22,39.62 0 bottom
C5  61.98,6.35 180 top
C6  59.18,9.14 90 top
C7  55.24,23.75 270 top
C8  53.09,23.75 270 top
C9  36.58,43.69 270 top
C11  61.98,4.32 180 top
C12  28.45,44.7 90 top
D1  15.75,6.6 0 top
D2  28.19,59.31 180 top
D3  50.29,12.32 270 top
GND  2.54,5.59 270 top
IC2  62.23,9.14 270 top
IC3  53.85,26.92 0 top
J2  39.12,35.81 180 top
L1  35.56,49.28 90 top
LED  2.54,17.53 270 top
LED1  60.45,11.94 0 top
LED2  17.78,25.15 180 top
LED3  3.81,26.42 270 top
LS1  37.59,7.62 90 top
NEG(-)  16.76,2.29 0 top
ORNG  26.42,27.18 90 top
OUT  2.54,9.4 270 top
POS(+)  10.92,2.29 0 top
Q1  24.38,45.72 180 top
Q2  29.46,28.7 90 top
Q3  7.62,27.94 0 top
Q4  22.1,27.18 90 top
Q5  16,29.97 180 top
Q6  13.46,22.86 270 top
Q7  37.08,28.45 90 top
Q8  17.27,8.89 180 top
Q9  27.18,7.62 270 top
R1  62.74,11.94 270 top
R2  62.23,13.72 0 top
R3  51.18,27.18 0 top
R4  51.18,26.04 0 top
R5  32.64,42.04 180 top
R6  32.51,40.51 0 top
R7  24.89,11.43 0 top
R8  28.96,11.43 0 top
R9  28.96,15.75 0 top
R10  28.96,13.46 180 top
R11  29.46,22.1 0 top
R12  30.23,25.91 0 top
R13  29.46,23.88 180 top
R14  6.86,23.62 0 top
R15  7.62,25.65 0 top
R16  19.05,19.56 270 top
R17  22.86,23.37 0 top
R18  19.81,32 0 top
R19  13.72,26.92 90 top
R20  19.3,29.72 0 top
R21  16.51,18.03 0 top
R22  16.51,20.32 180 top
R23  37.59,21.84 0 top
R24  38.1,25.65 0 top
R25  37.34,23.62 180 top
R26  19.81,9.65 90 top
R27  8.89,7.62 270 top
R28  11.68,7.62 90 top
R29  6.6,13.72 0 top
R30  40.64,43.69 90 top
R31  52.96,30.73 270 top
R32  54.99,30.73 270 top
SV1  51.56,3.68 180 top
TP1  26.8,58.67 0 top
TP2  48.01,11.81 0 top
TP3  42.67,41.4 270 top
TP4  43.43,45.72 270 top
TP5  9.91,13.72 90 top
TP6  57.28,6.73 0 top
TP7  33.91,37.85 0 top
TP8  30.23,9.91 0 top
TP9  7.24,38.23 0 top
TP10  5.33,38.23 0 top
TP11  8.76,4.7 0 top
TP12  19.18,2.41 0 top
TP13  20.32,25.78 0 top
TP14  14.61,29.21 0 top
TP15  15.88,22.1 0 top
TP16  3.43,29.59 0 top
TP17  26.29,30.86 0 top
TP18  35.56,29.84 0 top
TP19  46.48,10.67 0 top
TP20  22.1,42.67 0 top
TP21  34.92,41.27 0 top
TP22  62.99,2.67 0 top
U1  26.42,62.99 180 top
U$1  33.66,45.34 90 top
VDD  2.54,13.72 270 top
YEL  34.04,26.67 90 top

### Tracks (layer width: path | path; a pad name or v marks a point on that pad's centre or on a via)
+3V3  (via drill 0.35 pad 0.7, 0.61, 0.61 pad 1.91)
  Top 0.152: 7.62,23.62 R14.2
  Top 0.305: v35.69,21.84 R23.1
  Top 0.406: R27.1 v8.89,10.16 | v28.57,16.76 28.14,16.32 R9.1 | v28.07,21.46 28.7,22.1 R11.1
  Top 0.508: v58.17,30.73 55.84,30.73 R32.1 R31.1 | v20.07,18.8 19.11,18.8 R16.2 | v17.53,16.76 17.44,16.85 R21.2
  Top 0.61: v21.34,29.97 21.08,29.72 R20.2 | R29.2 7.45,14.69 v7.62,14.86 | v7.87,22.48 7.87,23.43 R14.2
  Top 0.813: R30.2 41.17,45.72 TP4.1
  other vias: 46.28,43.54
  pour Route15 (rank 2): 36.07,51.56 35.56,51.05 35.56,49.91 35.56,44.32 36.07,43.81 36.45,43.43 39.24,43.43 39.62,43.05 39.62,41.4 41.53,39.5 41.53,34.29 41.53,25.27 39.12,22.86 29.34,22.86 21.34,30.86 10.41,30.86 5.84,26.29 5.84,10.03 8.51,7.37 21.34,7.37 28.83,14.86 44.58,14.86 49.28,19.56 49.28,27.94 51.44,30.1 58.55,30.1 59.05,30.61 59.05,32.89 57.66,34.29 40.39,51.56
+3V6  (via drill 0.35 pad 0.75)
  Top 0.305: Q1.8 Q1.7 Q1.6 Q1.5 22.15,42.72 TP20.1 | 30.2,43.85 C12.1 28.41,43.81 v27.43,43.81 | C3.1 31.44,43.88 v31.5,43.94 | U$1.5 33.7,46.03 33.7,45.61 34.16,45.15 U$1.3 v34.16,43.69
  Top 0.508: Q1.6 24.38,43.05 Q1.9
  pour Route15 (rank 2): 21.97,43.69 21.34,43.05 21.34,41.66 22.61,40.39 28.57,40.39 30.73,42.55 35.05,42.55 35.31,42.8 35.31,43.31 33.53,45.09 24.64,45.09 23.24,43.69
+5V  (via drill 0.35 pad 0.7, 0.35 pad 0.9)
  Top 0.203: C11.1 63.25,4.32 | TP1.1 27.21,58.67 D2.2 27.72,59.44 U1.1
  Top 0.305: 62.8,6.6 C5.1 | C11.1 62.99,4.15 TP22.1 | v22.61,45.72 Q1.4
  Top 0.406: v64.77,8.13 63.6,8.13 IC2.4 | v63.63,12.95 63.49,12.95 R2.2
  Top 0.61: 63.25,4.32 v64.26,5.33 64.07,5.33 62.8,6.6
  pour Route15 (rank 2): 25.91,61.21 27.81,61.21 28.32,60.71 28.32,59.56 28.07,59.31 28.07,51.82 23.75,47.5 23.75,44.96 22.86,44.07 21.34,44.07 20.7,44.7 20.7,56.01
  pour Route15 (rank 2): 28.07,53.47 30.1,55.5 40.89,55.5 62.99,33.4 62.99,23.62 60.58,21.21 60.58,3.56 62.61,1.52 65.02,1.52 66.29,2.79 67.56,4.06 67.56,32.51 67.56,35.43 67.31,35.69 43.56,59.44 28.32,59.44 27.43,58.55 27.43,53.59 27.56,53.47
+VBAT  (via drill 0.35 pad 0.8, 0.61)
  Top 0.203: IC3.C3 54.61,26.16 54.61,25.23 | D3.2 50.31,11.95 SV1.1
  Top 0.305: Q1.1 26.12,46.48 v26.16,46.48 | SV1.1 47.22,9.93 TP19.1
  Top 0.381: Q1.3 Q1.2
  Top 0.457: Q1.2 Q1.1 | C7.1 54.61,25.23
  Top 0.508: v56.39,24.51 55.33,24.51 C7.1
  Top 1.27: TP2.1 49.88,9.93 SV1.1
  pour Route15 (rank 2): 28.45,51.56 24.13,47.24 24.13,45.97 24.64,45.47 27.3,45.47 33.78,51.94 40.64,51.94 59.44,33.15 59.44,30.23 49.78,20.57 49.78,19.43 44.58,14.22 44.58,10.41 47.24,7.75 50.42,7.75 51.56,8.89 51.56,12.83 62.61,23.88 62.61,33.15 40.77,54.99 30.23,54.99 28.45,53.21
GND  (via drill 0.35, 0.35 pad 0.6, 0.35 pad 0.85, 0.35 pad 0.9)
  Top 0.152: 36.52,42.98 C9.2 | 30.23,45.41 C3.2 | 28.35,45.26 C12.2 | 62.74,12.29 R1.1 | 23.01,28.19 Q4.2 | 30.48,29.72 Q2.2 | IC3.B2 IC3.C1 | D2.1 28.24,59.13 v28.57,58.8
  Top 0.203: IC3.C1 v52.58,25.65 | v50.42,13.08 50.29,12.95
  Top 0.305: C3.2 v30.23,46.74 | v28.45,46.74 C12.2 | C9.2 v36.58,41.4 | U$1.2 33.66,44.1 33.51,43.96 33.51,43.92 v33.27,43.69
  Top 0.457: 55.12,22.77 55.12,21.97 v54.74,21.59 54.61,21.46 v53.85,21.46 53.21,21.46 v53.09,21.59 C8.2 | Q3.2 8.57,27.75 v8.76,27.94 | Q9.2 26.18,5.6
  Top 0.533: Q2.2 30.48,29.67 v30.48,30.63
  Top 0.559: C1.2 v38.35,41.4
  Top 0.61: R28.2 11.71,9.14 v13.46,9.14 | Q8.2 15.26,9.89 v15.24,9.91 | 26.18,5.6 v26.16,5.59 | v3.81,4.32 GND.MP v3.81,6.86 | C5.2 v59.94,6.35 | C11.2 v59.94,4.32
  Top 1.27: SV1.2 53.85,8.9 v53.85,8.26 53.47,7.87 v52.83,7.87 52.07,7.87 v51.82,8.13
  Bottom 1.27: 50.29,13.08 v50.42,13.08 | 50.84,12.32 49.66,12.32
  other vias: 21.34,60.71 31.24,60.96 21.34,61.72 31.24,61.98 45.09,19.94 47.88,19.81 44.96,17.4 46.48,18.41 48.13,17.4 44.58,59.44 24.77,38.48 35.05,63.75 41.78,61.85 34.04,57.15 32.51,58.42 33.27,61.85 28.96,38.35 18.67,60.2 18.41,50.16 21.34,47.24 17.4,45.59 14.73,43.05 14.99,47.62 19.68,43.18 16.89,41.02 21.97,40.77 26.42,40.77 14.22,39.12 19.3,38.48 48.64,54.99 41.91,57.4 46.35,61.72 51.31,57.28 37.59,62.1 46.99,57.28 54.1,59.82 51.18,61.72 37.85,57.4 54.36,54.86 42.29,34.92 62.23,57.4 48.9,59.82 56.52,61.72 56.39,57.4 64.39,54.86 67.06,57.15 61.98,61.59 41.02,38.1 35.31,59.82 51.94,52.2 39.37,59.82 59.56,59.56 60.07,49.66 64.26,49.78 54.74,49.28 67.06,52.07 62.87,46.99 66.93,46.86 57.91,46.86 65.28,44.07 63.12,41.91 60.71,44.2 65.91,38.61 66.93,41.91 59.05,54.74 43.56,37.08 56.9,52.45 64.52,59.56 66.67,61.47 61.72,52.32 1.65,33.27 4.45,33.15 1.52,30.73 3.05,31.75 4.7,30.73 1.52,22.73 4.32,22.61 1.4,20.19 2.92,21.21 4.45,20.45 8.89,20.83 11.68,20.7 8.76,18.29 10.29,19.3 11.94,18.29 13.46,19.43 20.45,7.24 6.22,5.59 22.73,5.84 23.5,9.02 24.64,3.81 30.1,5.71 5.71,2.67 28.07,3.94 22.23,2.41 3.56,1.4 8,1.4 26.54,2.16 16.76,62.23 16.13,57.15 22.1,56.26 18.8,54.74 21.72,52.07 15.62,52.7 8.76,38.35 3.94,38.48
  pour Bottom (no thermals): 0,0 0,65.28 69.09,65.28 69.09,0
  pour Top (no thermals): 0,0 69.09,0 69.09,65.28 0,65.28
  pour Bottom (rank 4): 0,0 69.09,0 69.09,65.28 0,65.28
  pour Route2: 0,65.15 0,0 69.09,0 69.09,65.15
LED_BLUE
  Top 0.305: J2.9 20.63,33.98 R18.2
LED_GRN  (via drill 0.35)
  Top 0.305: v24.13,25.15 24.34,24.94 R17.2
  Bottom 0.305: J2.8 24.13,33.02 v24.13,25.15
LED_ORNG  (via drill 0.35)
  Top 0.305: R12.2 31.05,26.73 v32,27.69
  Bottom 0.305: J2.7 v32,27.69
LED_PRPL  (via drill 0.35)
  Top 0.305: v9.65,27.43 9.65,26.16 9.53,26.04 9.53,25.99 R15.2
  Bottom 0.305: v9.65,27.43 9.65,31.88 13.59,35.81 J2.11
LED_RED  (via drill 0.35)
  Top 0.305: R19.2 12.64,27.74 v11.94,28.45
  Bottom 0.305: v11.94,28.45 11.94,31.5 J2.10
LED_YEL  (via drill 0.35)
  Top 0.305: R24.2 38.92,26.73 v39.62,27.43
  Bottom 0.305: J2.6 30.99,31.24 35.81,31.24 v39.62,27.43
MOTOR  (via drill 0.35)
  Top 0.305: R26.1 20.12,9.14 v21.08,9.14
  Bottom 0.305: J2.5 32.51,32.26 36.07,32.26 41.91,26.42 41.91,16 40.39,14.48 23.37,14.48 21.08,12.19 v21.08,9.14
N$1
  Top 0.305: Q9.1 25.71,9.04 R7.2
N$3
  Top 0.152: 28.19,7.62 Q9.3
  Top 0.305: R8.1 28.19,11.37 28.19,7.62
  Top 0.61: Q9.3 LS1.1
N$4
  Top 0.305: R1.2 63.53,10.65 IC2.5
N$5
  Top 0.305: U$1.4 34.16,49.14 L1.1
N$6
  Top 0.203: R5.2 32.14,40.99 R6.1
  Top 0.254: U$1.1 32.14,43.59 R5.2
N$7
  Top 0.305: IC2.1 59.7,11.32 LED1.1
N$8
  Top 0.305: LED1.2 61.2,13.19 R2.1
N$9
  Top 0.305: Q8.1 18.8,10.47 R26.2
N$10
  Top 0.203: IC3.B1 53.07,26.92 52.18,26.04 R4.2
N$12
  Top 0.305: R10.1 29.78,13.14 R8.2 29.78,10.36 TP8.1
  Top 0.508: R9.2 29.78,13.78 R10.1
  Top 0.61: R8.2 36.15,11.43 LS1.2
N$13
  Top 0.305: D1.C 13.58,6.12 R28.1 R27.2 8.76,6 TP11.1
  Top 0.61: R28.1 11.68,3.05 POS(+).MP
N$14
  Top 0.305: R12.1 29.41,26.69 Q2.1
N$15
  Top 0.305: TP17.1 26.42,30.73 ORNG.K
  Top 0.533: ORNG.K 26.67,28.7 Q2.3
N$16
  Top 0.203: R13.1 30.28,22.37 R11.2
N$17
  Top 0.533: R13.2 28.45,23.88 ORNG.A
N$18
  Top 0.203: R5.1 35.18,42.04 35.56,42.42 35.56,43.49 C9.1
  Top 0.305: R5.1 34.16,42.04 TP21.1
  Top 0.559: C1.1 39.09,43.77 39.25,43.77 40.64,42.38 R30.1
  Top 0.61: 36.58,49.02 L1.2
  Top 0.711: 36.58,49.02 C9.1 C1.1
  Top 0.813: R30.1 41.89,42.19 TP3.1
N$19
  Top 0.305: Q3.1 6.8,26.81 R15.1
N$20
  Top 0.305: Q3.3 4.83,28.94 LED3.1 3.43,28.3 TP16.1
N$21
  Top 0.305: LED3.2 5.1,23.62 R14.1
N$22
  Top 0.305: R22.2 15.69,18.14 R21.1
N$23
  Top 0.305: Q4.1 23.1,24.43 R17.1
N$24
  Top 0.305: LED2.C1 19.31,27.05 20.97,27.05 Q4.3 20.32,26.4 TP13.1
N$25
  Top 0.305: Q8.3 17.27,6.76 D1.A | NEG(-).MP 19.05,2.29 TP12.1
  Top 0.61: D1.A 17.43,2.95 NEG(-).MP
N$26
  Top 0.305: Q5.1 17.98,32 R18.1
N$27  (via drill 0.35 pad 0.9)
  Top 0.203: IC3.C2 53.85,25.72 53.09,24.96 C8.1
  Top 0.305: IC2.3 59.31,8.19 C6.1 | TP6.1 57.28,8 v57.53,8.26
  Top 0.508: C6.1 59.11,8.26 v57.53,8.26
  Top 0.635: C8.1 53,24.51 v51.05,24.51
  Bottom 1.27: v51.05,24.51 51.05,20.19 57.53,13.72 v57.53,8.26
N$28
  Top 0.305: R19.1 13.72,25.06 Q6.1
N$29
  Top 0.305: LED2.C3 16.68,28.29 Q5.3 14.84,28.97 TP14.1
N$30
  Top 0.305: LED2.A3 17.78,29.12 R20.1
N$31
  Top 0.305: LED2.A1 18.88,20.55 R16.1
N$32
  Top 0.305: LED2.C2 15.27,23.67 Q6.3 15.22,22.1 TP15.1
N$33
  Top 0.203: LED2.A2 17.78,23.62
  Top 0.305: 17.78,23.62 17.78,20.77 R22.1
N$36
  Top 0.305: R24.1 37.28,26.69 Q7.1
N$37
  Top 0.305: TP18.1 35.56,28.97 Q7.3
  Top 0.61: Q7.3 35.58,27.94 YEL.K
N$38
  Top 0.61: R25.2 35.81,23.62 YEL.A
N$39
  Top 0.305: R25.1 38.41,23.37 38.41,21.95 R23.2
N$43  (via drill 0.35)
  Top 0.203: IC3.B3 54.47,27.05 54.5,27.05 54.88,27.43 C2.1 55.75,27.47 v55.75,28.32 | R3.1 v49.91,27.18
  Route15 0.203: v49.91,27.18 54.61,27.18 v55.75,28.32
NFC1
  Bottom 0.381: ANT1.1 8.57,44.32 6.82,42.58 C4.1 7.24,39.21 TP9.1 7.24,36.96 J2.14
NFC2
  Bottom 0.381: ANT1.2 3.62,50.93 3.62,44.42 5.62,42.42 C4.2 5.62,38.52 TP10.1 5.33,37.59 J2.15
SCL  (via drill 0.35)
  Top 0.203: v54.61,28.45 54.61,27.69 IC3.A3
  Top 0.305: v54.61,28.45 54.61,29.5 R32.2
  Bottom 0.305: v54.61,28.45 52.42,30.64 44.29,30.64 J2.1
SDA  (via drill 0.35)
  Top 0.203: v53.59,28.45 v53.59,28.44 53.85,28.19 IC3.A2
  Top 0.305: R31.2 52.96,29.08 v53.59,28.45
  Bottom 0.305: v53.59,28.45 52.42,29.62 43.15,29.62 36.96,35.81 J2.2
SOC  (via drill 0.35)
  Top 0.203: IC3.A1 53.09,27.68 52.33,27.68 v52.07,27.94 51.68,27.55 R3.2
  Top 0.305: TP7.1 33.91,35.94 J2.3
  Bottom 0.305: J2.3 35.94,33.91 37.34,33.91 43.31,27.94 v52.07,27.94
SPKR  (via drill 0.35)
  Top 0.305: R7.1 23.41,13 v23.62,13.21
  Bottom 0.305: J2.4 34.16,33.15 36.45,33.15 42.8,26.8 42.8,15.75 42.8,15.62 40.39,13.21 v23.62,13.21
TOUCHLED
  Bottom 0.305: J2.13 5.43,32.6 5.43,20.41 LED.MP
TOUCHOUT
  Bottom 0.305: OUT.MP 6.86,13.72 6.86,31.5 J2.12
TOUCHVDD
  Top 0.61: R29.1 VDD.MP
(copper drawn outside any net)
  shapes: Route15 area x1

### Text on the board
tPlace: TOUCHOUT | PRPL | RED | BLUE | GRN | ORNG | YEL | NFC2 | NFC1 | TCHLED | MOTOR | SPKR | SOC | SDA | SCL